# EAGLE design SolderStation_LCD_v1 (EAGLE 7.2.0)
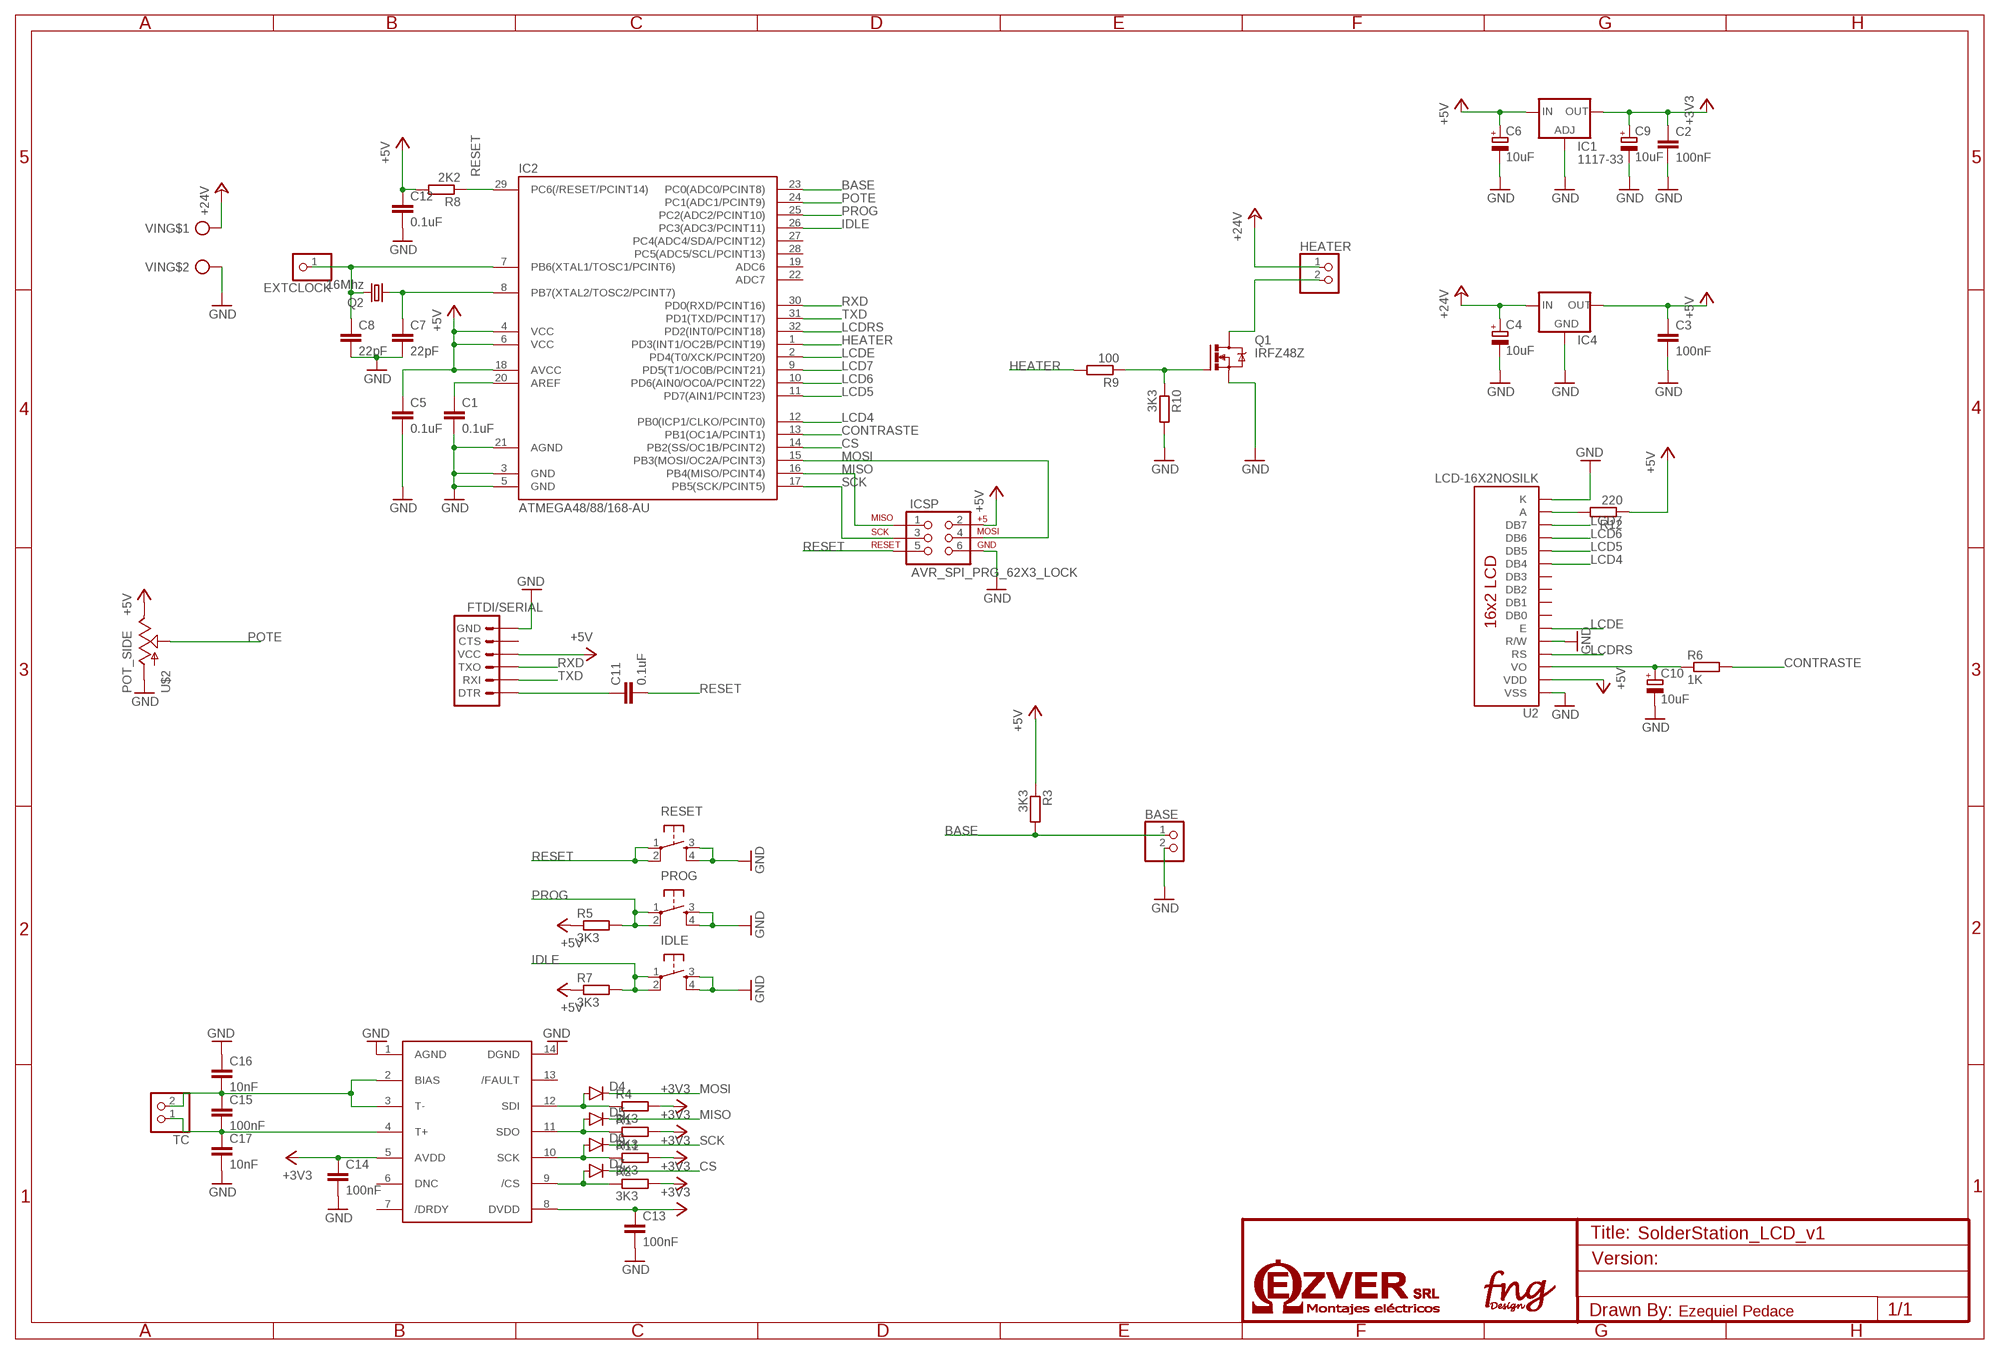
[diagram p0: schematic, sheet 1]

## Parts
BASE  PINHD-1X2  [1X02]
C1  0.1uF  C-EUC1206K  [C1206K]
C2  100nF  C-EUC1206K  [C1206K]
C3  100nF  C-EUC1206K  [C1206K]
C4  10uF  CPOL-EUCT3528  [CT3528]
C5  0.1uF  C-EUC1206K  [C1206K]
C6  10uF  CPOL-EUCT3528  [CT3528]
C7  22pF  C-EUC1206K  [C1206K]
C8  22pF  C-EUC1206K  [C1206K]
C9  10uF  CPOL-EUCT3528  [CT3528]
C10  10uF  CPOL-EUCT3528  [CT3528]
C11  0.1uF  C-EUC1206K  [C1206K]
C12  0.1uF  C-EUC1206K  [C1206K]
C13  100nF  C-EUC1206K  [C1206K]
C14  100nF  C-EUC1206K  [C1206K]
C15  100nF  C-EUC1206K  [C1206K]
C16  10nF  C-EUC1206K  [C1206K]
C17  10nF  C-EUC1206K  [C1206K]
D4  DIODESOD123  [SOD-123]
D5  DIODESOD123  [SOD-123]
D6  DIODESOD123  [SOD-123]
D7  DIODESOD123  [SOD-123]
EXTCLOCK  PINHD-1X1  [1X01]
FTDI/SERIAL  ARDUINO_SERIAL_PROGRAMLOCK  [1X06_LOCK]
HEATER  PINHD-1X2  [1X02]
IC1  1117-33  LD117ADT33TR  [DPACK]
IC2  ATMEGA48/88/168-AU  [TQFP32-08]
IC4  78XXL  [78XXL]
ICSP  AVR_SPI_PRG_62X3_LOCK  [2X3_LOCK]
IDLE  TAC_SWITCHPTH  [TACTILE-PTH]
PROG  TAC_SWITCHPTH  [TACTILE-PTH]
Q1  IRFZ48Z  [TO220BH]
Q2  16Mhz  CRYSTALHC49U70  [HC49U70]
R1  3K3  R-EU_M1206  [M1206]
R2  3K3  R-EU_M1206  [M1206]
R3  3K3  R-EU_M1206  [M1206]
R4  3K3  R-EU_M1206  [M1206]
R5  3K3  R-EU_M1206  [M1206]
R6  1K  R-EU_M1206  [M1206]
R7  3K3  R-EU_M1206  [M1206]
R8  2K2  R-EU_M1206  [M1206]
R9  100  R-EU_M1206  [M1206]
R10  3K3  R-EU_M1206  [M1206]
R11  3K3  R-EU_M1206  [M1206]
R12  220  R-EU_M1206  [M1206]
RESET  TAC_SWITCHPTH  [TACTILE-PTH]
TC  PINHD-1X2  [1X02]
TC1  MAX31856  [TSSOP-14]
U2  LCD-16X2NOSILK  [LCD-16X2_NOSILK]
U$2  POT_SIDE  [POT_ALPHA_SIDE]
VIN  CON2  [CON2]

## Nets
+3V3: C2.1 C9.+ C13.1 C14.1 IC1.4(OUT) R1.2 R2.2 R4.2 R11.2 TC1.5(AVDD) TC1.8(DVDD)
+5V: C3.1 C5.1 C6.+ C12.1 FTDI/SERIAL.4(VCC) IC1.3(IN) IC2.4(VCC) IC2.6(VCC) IC2.18(AVCC) IC4.OUT ICSP.2 R3.1 R5.1 R7.1 R8.2 R12.1 U2.2(VDD) U$2.3(E)
+24V: C4.+ HEATER.1 IC4.IN VIN.1
BASE: BASE.1 IC2.23(PC0(ADC0/PCINT8)) R3.2
CONTRASTE: IC2.13(PB1(OC1A/PCINT1)) R6.2
CS: D7.C IC2.14(PB2(SS/OC1B/PCINT2))
GND: BASE.2 C1.2 C2.2 C3.2 C4.- C5.2 C6.- C7.2 C8.2 C9.- C10.- C12.2 C13.2 C14.2 C16.1 C17.2 FTDI/SERIAL.6(GND) IC1.1(ADJ) IC2.3(GND) IC2.5(GND) IC2.21(AGND) IC4.GND ICSP.6 IDLE.3 IDLE.4 PROG.3 PROG.4 Q1.S R10.2 RESET.3 RESET.4 TC1.1(AGND) TC1.14(DGND) U2.1(VSS) U2.5(R/W) U2.16(K) U$2.1(A) VIN.2
HEATER: IC2.1(PD3(INT1/OC2B/PCINT19)) R9.2
IDLE: IC2.26(PC3(ADC3/PCINT11)) IDLE.1 IDLE.2 R7.2
LCD4: IC2.12(PB0(ICP1/CLKO/PCINT0)) U2.11(DB4)
LCD5: IC2.11(PD7(AIN1/PCINT23)) U2.12(DB5)
LCD6: IC2.10(PD6(AIN0/OC0A/PCINT22)) U2.13(DB6)
LCD7: IC2.9(PD5(T1/OC0B/PCINT21)) U2.14(DB7)
LCDE: IC2.2(PD4(T0/XCK/PCINT20)) U2.6(E)
LCDRS: IC2.32(PD2(INT0/PCINT18)) U2.4(RS)
MISO: D5.C IC2.16(PB4(MISO/PCINT4)) ICSP.1
MOSI: D4.C IC2.15(PB3(MOSI/OC2A/PCINT3)) ICSP.4
N$1: Q1.G R9.1 R10.1
N$2: D7.A R2.1 TC1.9(/CS)
N$3: D6.A R11.1 TC1.10(SCK)
N$4: D5.A R1.1 TC1.11(SDO)
N$5: HEATER.2 Q1.D
N$6: D4.A R4.1 TC1.12(SDI)
N$7: C7.1 IC2.8(PB7(XTAL2/TOSC2/PCINT7)) Q2.1
N$8: C10.+ R6.1 U2.3(VO)
N$9: C8.1 EXTCLOCK.1 IC2.7(PB6(XTAL1/TOSC1/PCINT6)) Q2.2
N$10: C1.1 IC2.20(AREF)
N$11: R12.2 U2.15(A)
N$14: C11.1 FTDI/SERIAL.1(DTR)
N$15: C15.2 C17.1 TC1.4(T+) TC.1
N$16: C15.1 C16.2 TC1.2(BIAS) TC1.3(T-) TC.2
POTE: IC2.24(PC1(ADC1/PCINT9)) U$2.2(S)
PROG: IC2.25(PC2(ADC2/PCINT10)) PROG.1 PROG.2 R5.2
RESET: C11.2 IC2.29(PC6(/RESET/PCINT14)) ICSP.5 R8.1 RESET.1 RESET.2
RXD: FTDI/SERIAL.3(TXO) IC2.30(PD0(RXD/PCINT16))
SCK: D6.C IC2.17(PB5(SCK/PCINT5)) ICSP.3
TXD: FTDI/SERIAL.2(RXI) IC2.31(PD1(TXD/PCINT17))
Unconnected: FTDI/SERIAL.5(CTS) IC2.19(ADC6) IC2.22(ADC7) IC2.27(PC4(ADC4/SDA/PCINT12)) IC2.28(PC5(ADC5/SCL/PCINT13)) TC1.6(DNC) TC1.7(/DRDY) TC1.13(/FAULT) U2.7(DB0) U2.8(DB1) U2.9(DB2) U2.10(DB3)

## Library data of the parts
BASE HEATER TC = pinhead:PINHD-1X2: PIN HEADER
C1-C3 C5 C7 C8 C11-C17 = rcl:C-EU: CAPACITOR, European symbol
C4 C6 C9 C10 = rcl:CPOL-EU: POLARIZED CAPACITOR, European symbol
D4-D7 = SparkFun-DiscreteSemi:DIODE: Diode These are standard reverse protection diodes and small signal diodes. SMA package can handle up to about 1A. SOD-323 can handle about 200mA. What the SOD-323 package when ordering, there are some mfgs out there that are 5-pin packages.
EXTCLOCK = pinhead:PINHD-1X1: PIN HEADER
FTDI/SERIAL = SparkFun-Connectors:ARDUINO_SERIAL_PROGRAM: FTDI connector footprints
IC1 = v-reg:LD117A?*: Low drop fixed and adjustable positive voltage regulators 1 A Source: http://www.st.com/stonline/products/literature/ds/7194/ld1117axx.pdf
IC2 = atmega8:ATMEGA48/88/168
IC4 = v-reg:78XXL: VOLTAGE REGULATOR
ICSP = SparkFun-Connectors:AVR_SPI_PRG_6: AVR ISP 6 Pin This is the reduced ISP connector for AVR programming. Common on Arduino. This footprint will take up less PCB space and can be used with a 10-pin to 6-pin adapter such as SKU: BOB-08508 **Special note about "TEST_POINT" package. The stop mask is on the top side, so if you want your programming test points to be on the bottom of your board, make sure to place this package on the bottom side of the board. This also ensure that the orientation to program from the bottom side will be correct.
IDLE PROG RESET = SparkFun-Electromechanical:TAC_SWITCH: Momentary Switch Button commonly used for reset or general input. Spark Fun Electronics SKU : COM-00097
Q1 = transistor-power:IRFZ48: N Channel HEXFET® Power MOSFET Logic Level Source: http://www.irf.com/product-info/datasheets/data/irfz48z.pdf
Q2 = crystal:CRYSTAL: CRYSTAL; OC_FARNELL: unknown; OC_NEWARK: unknown
R1-R12 = rcl:R-EU_: RESISTOR, European symbol
TC1 = SparkFun-AnalogIC:MAX31856
U2 = SparkFun-Displays:LCD-16X2: Standard text-only 16x2 parallel input LCD
U$2 = SparkFun-Electromechanical:POT_SIDE
VIN = con-phoenix-smkdsp:CON2

## Net classes
1 vcc: width 0.254 mm

## Board
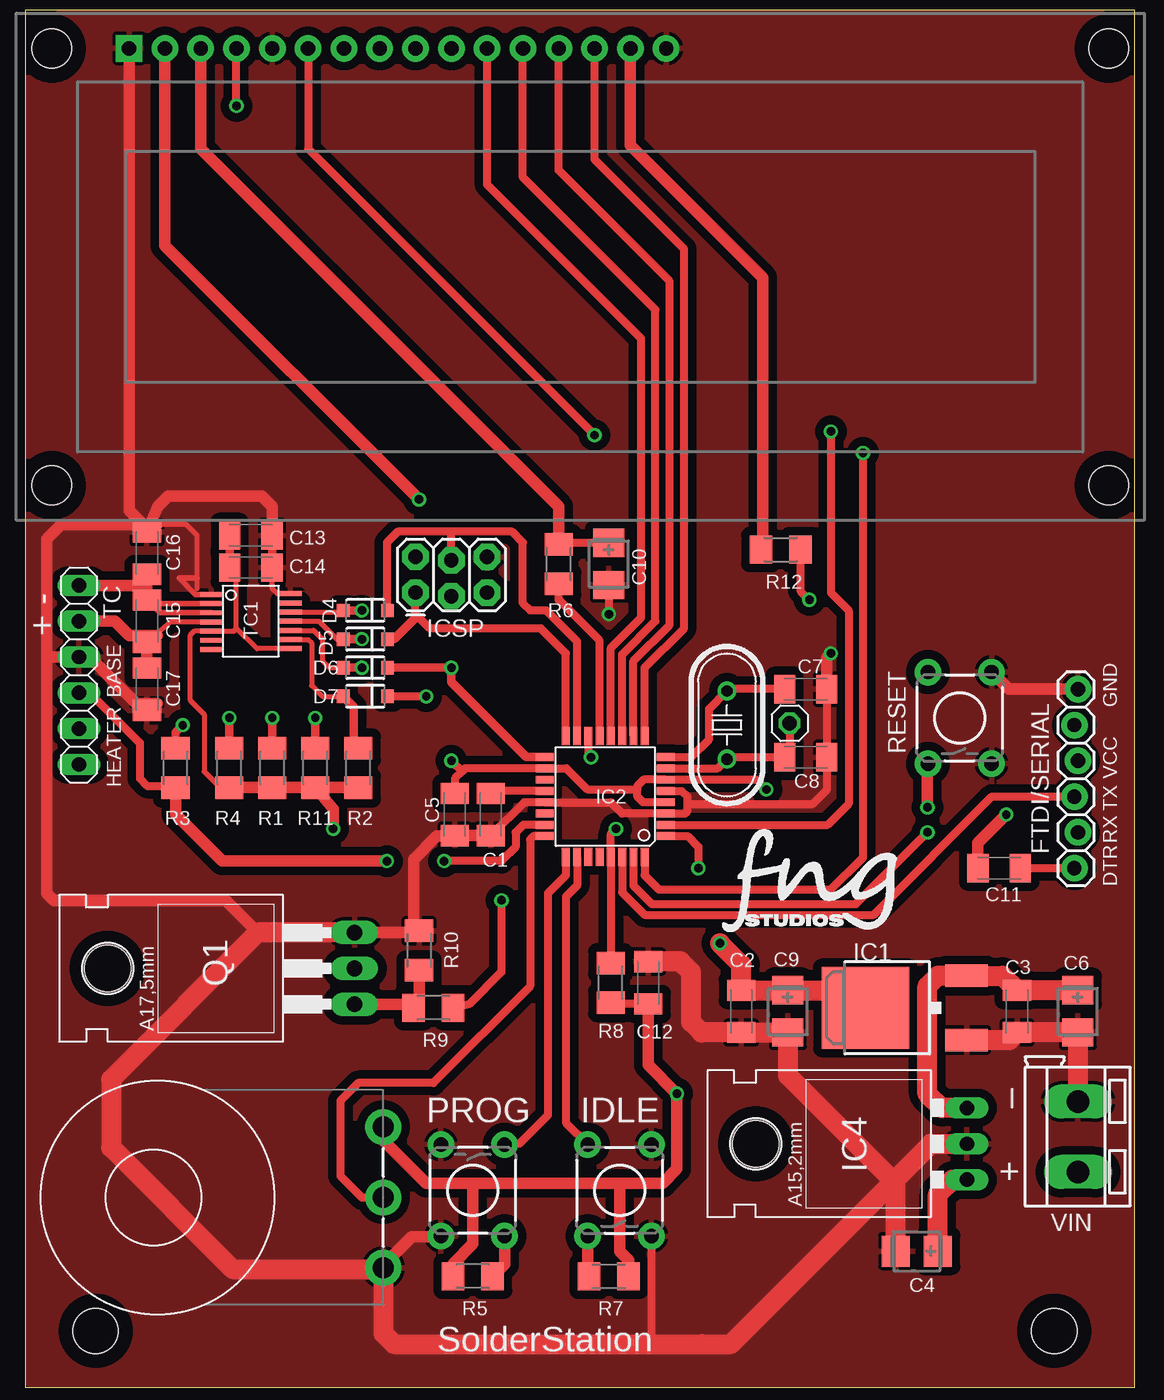
[diagram p1: board, top side]
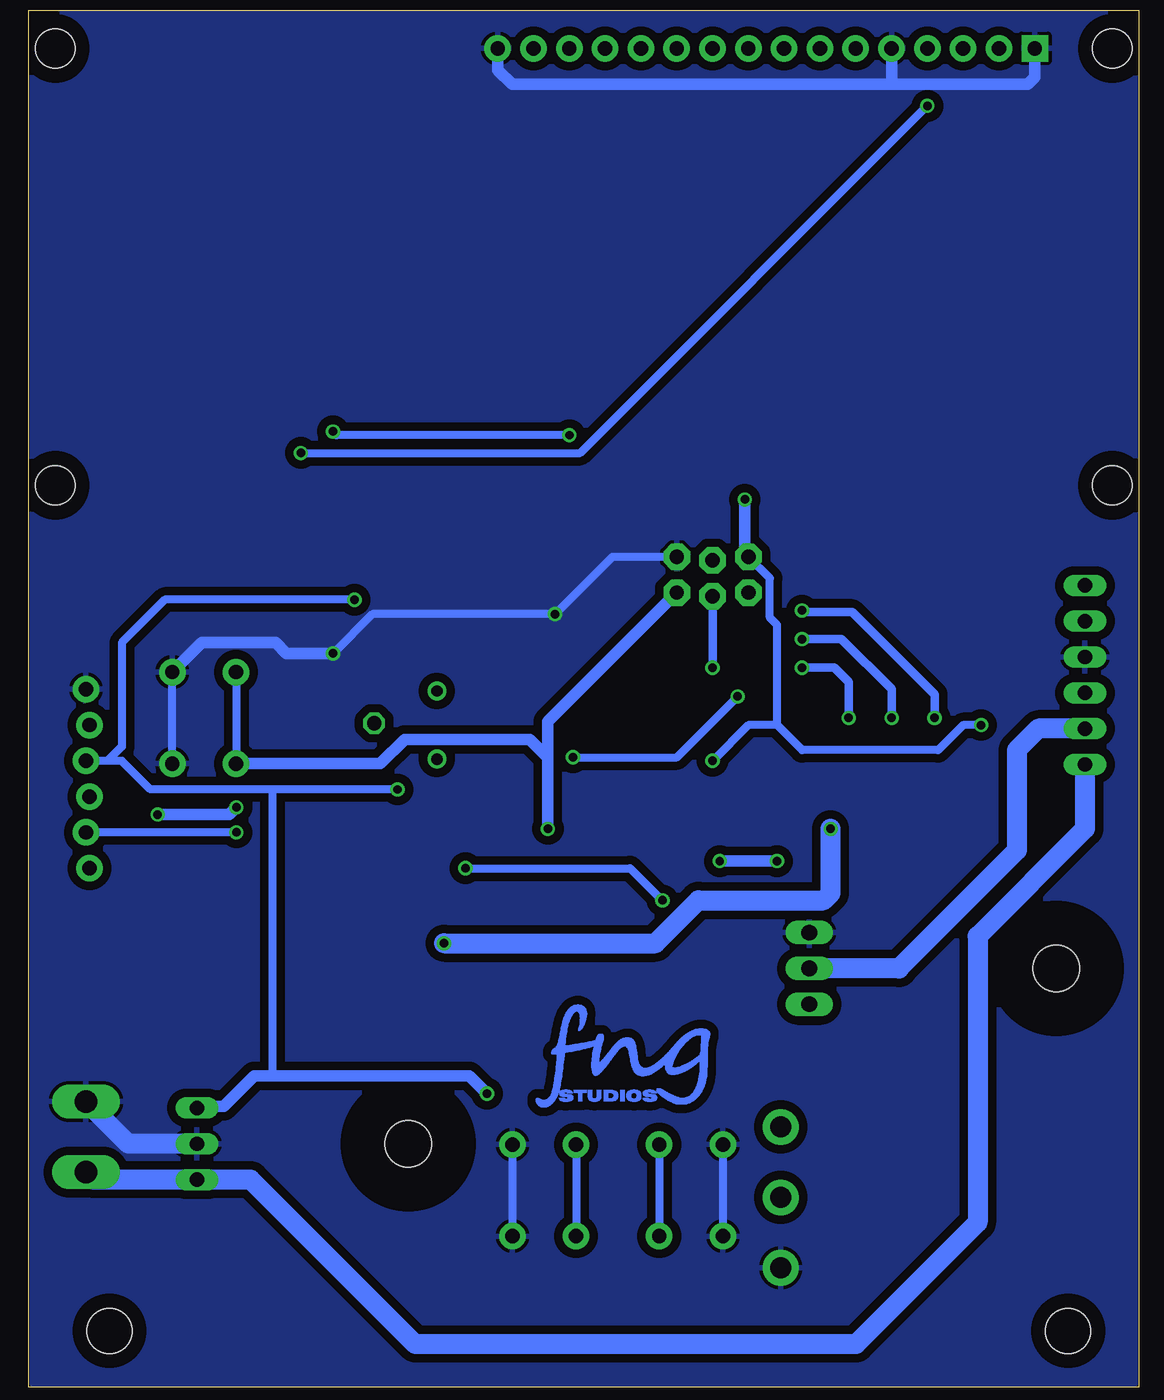
[diagram p2: board, bottom side, seen from below]

No outline drawn. Coordinates in mm, seen from the top.
Copper layers (1*16): Top 0.035mm / dielectric 1.5mm / Bottom 0.035mm
Design rules "default": minimum track width 10mil, minimum drill 0.6mm, track to track 8mil, track to pad 8mil, pad to pad 8mil, via to via 8mil, smd to smd 8mil, copper to edge 40mil, drill to drill 8mil, minimum pad ring 10mil, minimum via ring 8mil, stop-mask expansion 4mil, vias tented up to drill 0mil, thermal gap 10mil
Holes 3.2 mm at 5,4 73,4
Milling: 4 lines

### Footprints (pad centres in the part's own frame; a part is rotated, then mirrored left to right if it is on the bottom)
1X02 = drill 1.016 long: 1 -1.27,0; 2 1.27,0
C1206K = smd 1.5 x 2: 1 -1.5,0; 2 1.5,0
CT3528 = smd 2 x 2.2: + -1.5,0; - 1.5,0
SOD-123 = smd 0.9 x 0.95: A 1.575,0; C -1.575,0
1X01 = drill 1.016 octagon: 1 0,0
1X06_LOCK = drill 1.016 pad 1.88: 1 0,0; 2 2.54,-0.254; 3 5.08,0; 4 7.62,-0.254; 5 10.16,0; 6 12.7,-0.254
DPACK = smd 1.6 x 3: 1 -2.28,-4.8; 3 2.28,-4.8 | smd 5.8 x 6.2: 4 0,2.38
TQFP32-08 = smd 1.27 x 0.559: 1 -4.293,2.8; 2 -4.293,2; 3 -4.293,1.2; 4 -4.293,0.4; 5 -4.293,-0.4; 6 -4.293,-1.2; 7 -4.293,-2; 8 -4.293,-2.8; 17 4.293,-2.8; 18 4.293,-2; 19 4.293,-1.2; 20 4.293,-0.4; 21 4.293,0.4; 22 4.293,1.2; 23 4.293,2; 24 4.293,2.8 | smd 0.559 x 1.27: 9 -2.8,-4.293; 10 -2,-4.293; 11 -1.2,-4.293; 12 -0.4,-4.293; 13 0.4,-4.293; 14 1.2,-4.293; 15 2,-4.293; 16 2.8,-4.293; 25 2.8,4.293; 26 2,4.293; 27 1.2,4.293; 28 0.4,4.293; 29 -0.4,4.293; 30 -1.2,4.293; 31 -2,4.293; 32 -2.8,4.293
78XXL = drill 1.016 long: GND 0,-3.81; IN -2.54,-3.81; OUT 2.54,-3.81 | hole 3.302: 0,11.176
2X3_LOCK = drill 1.016 pad 1.88 octagon: 1 0,0; 2 0,2.54; 3 2.54,-0.254; 4 2.54,2.286; 5 5.08,0; 6 5.08,2.54
TACTILE-PTH = drill 1.016 pad 1.88: 1 -3.251,2.261; 2 3.251,2.261; 3 -3.251,-2.261; 4 3.251,-2.261
TO220BH = drill 1.118 long: D 0,-6.35; G -2.54,-6.35; S 2.54,-6.35 | hole 3.302: 0,11.176
HC49U70 = drill 0.813: 1 -2.413,0; 2 2.413,0
M1206 = smd 1.6 x 2: 1 -1.4,0; 2 1.4,0
TSSOP-14 = smd 1.6 x 0.35: 1 -2.8,1.9; 2 -2.8,1.25; 3 -2.8,0.6; 4 -2.8,-0.05; 5 -2.8,-0.7; 6 -2.8,-1.35; 7 -2.8,-2; 8 2.8,-1.95; 9 2.8,-1.3; 10 2.8,-0.65; 11 2.8,0; 12 2.8,0.65; 13 2.8,1.3; 14 2.8,1.95
LCD-16X2_NOSILK = drill 1.016 pad 1.88 square: 1 -32,15.5 | drill 1.016 pad 1.88: 2 -29.46,15.5; 3 -26.92,15.5; 4 -24.38,15.5; 5 -21.84,15.5; 6 -19.3,15.5; 7 -16.76,15.5; 8 -14.22,15.5; 9 -11.68,15.5; 10 -9.14,15.5; 11 -6.6,15.5; 12 -4.06,15.5; 13 -1.52,15.5; 14 1.02,15.5; 15 3.56,15.5; 16 6.1,15.5 | hole 2.8: -37.5,15.5; -37.5,-15.5; 37.5,15.5; 37.5,-15.5
POT_ALPHA_SIDE = drill 1.5 pad 2.54: 1 -5,-6.35; 2 0,-6.35; 3 5,-6.35
CON2 = drill 1.6 pad 1.8 long: 1 -2.5,0; 2 2.5,0

### Placement (x,y rotation side)
BASE  3.81,50.55 90 top
C1  33.02,40.64 270 top
C2  50.8,26.67 270 top
C3  70.36,26.67 270 top
C4  63.25,9.65 180 top
C5  30.48,40.64 270 top
C6  74.68,26.67 270 top
C7  55.37,49.53 0 top
C8  55.37,44.7 0 top
C9  54.1,26.67 270 top
C10  41.4,58.42 270 top
C11  69.09,36.83 180 top
C12  44.2,28.7 90 top
C13  16,60.45 0 top
C14  16,58.17 0 top
C15  8.64,54.36 270 top
C16  8.64,59.18 270 top
C17  8.64,49.53 270 top
D4  24.13,55.12 180 top
D5  24.13,53.09 180 top
D6  24.13,51.05 180 top
D7  24.13,49.02 180 top
EXTCLOCK  54.23,47.12 0 top
FTDI/SERIAL  74.42,36.83 90 top
HEATER  3.81,45.47 90 top
IC1  61.98,26.92 90 top
IC2  41.15,41.91 180 top
IC4  62.99,17.27 90 top
ICSP  27.69,56.39 0 top
IDLE  42.16,13.97 90 top
PROG  31.75,13.97 270 top
Q1  17.02,29.72 90 top
Q2  49.78,46.99 270 top
R1  17.53,43.94 270 top
R2  23.62,43.94 270 top
R3  10.67,43.94 270 top
R4  14.48,43.94 270 top
R5  31.75,7.87 0 top
R6  37.85,58.42 270 top
R7  41.4,7.87 180 top
R8  41.53,28.7 270 top
R9  28.96,26.92 0 top
R10  27.94,30.99 90 top
R11  20.57,43.94 270 top
R12  53.59,59.44 180 top
RESET  66.29,47.5 90 top
TC  3.81,55.63 90 top
TC1  16,54.36 0 top
U2  39.37,79.5 0 top
U$2  19.05,13.46 90 top
U$4  [LOGOFNG]  43.43,18.8 0 bottom
U$5  [LOGOFNGNAME1]  48.77,31.24 0 top
VIN  74.68,17.78 90 top

### Tracks (layer width: path | path; a pad name or v marks a point on that pad's centre or on a via)
+3V3  (via drill 0.6)
  Top 0.356: 14.99,53.85 14.79,53.66 TC1.5 12,53.66 11.68,53.34 11.68,48.77 12.7,47.75 12.7,43.69 13.85,42.54 | 14.99,53.85 14.99,57.94 C14.1 | TC1.8 16.43,52.41 14.99,53.85
  Top 0.61: R4.2 13.85,42.54 | C13.1 C14.1
  Top 0.813: v21.84,39.62 21.84,41.02 R11.2 | R4.2 R1.2 R11.2 | R11.2 R2.2
  Top 1.422: IC1.4 58.35,28.17 C9.+ C2.1 50.8,29.97 v49.28,31.5
  Bottom 1.422: v49.28,31.5 34.29,31.5 31.24,34.54 22.35,34.54 21.84,35.05 v21.84,39.62
+5V  (via drill 0.6)
  Top 0.559: IC2.4 43.83,41.51 43.43,41.91 43.43,42.42 | 43.43,42.42 43.43,42.67 43.87,43.11 IC2.6 51.89,43.11 v52.58,42.42 | 43.43,42.42 39.88,42.42 38.39,43.91 IC2.18 31.21,43.91 30.99,43.69 | 30.99,43.69 30.48,43.18 C5.1 | R3.1 10.67,46.48 v11.18,46.99 | v30.23,44.45 30.99,43.69 | C12.1 41.63,27.2 R8.2 | R12.1 54.99,56.51 v55.63,55.88
  Top 0.813: C12.1 44.2,22.86 v46.23,20.83 46.23,15.49 45.21,14.48 42.42,14.48 | U$2.3 25.4,17.53 28.45,14.48 32,14.48 | 32,14.48 42.42,14.48 | R5.1 30.35,8.76 31.75,10.16 31.75,14.22 32,14.48 | R7.1 42.8,9.01 42.16,9.65 42.16,14.22 42.42,14.48 | U2.2 9.91,81.02 v27.94,62.99
  Top 1.422: IC4.OUT 65.02,19.81 64.01,20.83 64.01,28.45 64.77,29.21 IC1.3 69.32,29.2 C3.1 C6.+
  Bottom 0.559: v52.58,42.42 61.47,42.42 | 61.47,42.42 70.1,42.42 72.14,44.45 73.15,44.45 | 73.15,44.45 FTDI/SERIAL.4 | v11.18,46.99 12.45,46.99 14.22,45.21 23.88,45.21 25.65,46.99 | 25.65,46.99 25.65,54.1 26.16,54.61 26.16,57.4 ICSP.2 | 25.65,46.99 27.69,46.99 v30.23,44.45 | v55.63,55.88 69.09,55.88 72.14,52.83 72.14,45.47 73.15,44.45 | 61.47,42.42 61.47,22.1
  Bottom 0.813: IC4.OUT 66.29,19.81 66.17,19.94 64.9,19.94 62.74,22.1 61.47,22.1 47.5,22.1 v46.23,20.83 | v27.94,62.99 27.94,59.18 ICSP.2
+24V
  Top 1.422: C4.+ 64.75,13.69 65.79,14.73 IC4.IN
  Bottom 1.422: 65.53,14.73 IC4.IN | IC4.IN 74.13,14.73 VIN.1 | IC4.IN 62.99,14.73 51.31,3.05 20.07,3.05 11.43,11.68 11.43,32 3.81,39.62 HEATER.1
BASE  (via drill 0.6)
  Top 0.559: IC2.23 35.34,39.91 34.8,39.37 34.8,38.35 33.78,37.34 v29.72,37.34 | BASE.1 4.57,49.28 8.13,45.72 8.13,43.18 8.64,42.67 10.54,42.67 R3.2
  Top 0.813: R3.2 10.67,40.64 13.97,37.34 v25.65,37.34
  Bottom 0.813: v25.65,37.34 v29.72,37.34
CONTRASTE
  Top 0.559: IC2.13 40.75,52.98 37.85,55.88 R6.2
CS  (via drill 0.6)
  Top 0.559: IC2.14 39.95,44.89 v40.13,44.7 | v28.45,49.02 D7.C
  Bottom 0.559: v40.13,44.7 32.77,44.7 v28.45,49.02
GND  (via drill 0.6)
  Top 0.356: TC1.14 17.86,56.31 17.53,56.64 17.53,58.4 C14.2 17.53,58.44 | TC1.1 12.58,56.26 | 12.19,56.64 12.19,57.4 12.19,60.45 11.43,61.21 9.42,61.21 C16.1 | 17.02,60.45 17.53,59.94
  Top 0.406: 12.58,56.26 12.07,56.26 10.92,57.4 12.19,57.4
  Top 0.559: C7.2 C8.2 56.9,44.68 56.9,42.42 55.88,41.4 46.99,41.4 | IC2.5 46.59,42.31 46.99,41.91 46.99,41.4 | 46.99,41.4 46.99,40.89 46.81,40.71 IC2.3 42.35,40.71 41.55,41.51 IC2.21 35.39,41.51 C1.2 | C10.- v41.4,54.86 | 7.37,61.22 7.37,61.21 | IDLE.3 44.42,3.28 44.2,3.05
  Top 0.61: 17.53,58.44 17.53,60.68 | 17.53,60.68 C13.2 | 17.53,60.68 17.25,60.68 17.02,60.45
  Top 0.813: C17.2 9.37,48.51 7.87,48.51 4.57,51.82 BASE.2 1.52,51.82 | C1.2 C5.2 30.46,39.12 29.21,39.12 27.56,37.46 27.56,32.38 27.43,32.26 | 47.75,3.3 48.01,3.05 | C7.2 56.87,51.79 v57.15,52.07 | 8.38,61.21 7.37,61.21 2.54,61.21 1.52,60.2 1.52,51.82 | 8.38,61.21 9.37,61.21 C16.1 9.4,62.48 10.16,63.25 16.76,63.25 17.53,62.48 17.53,60.73 C13.2 | 1.52,51.82 1.52,35.05 2.03,34.54 14.22,34.54 16.51,32.26 | FTDI/SERIAL.6 69.77,49.53 RESET.4 | Q1.S 27.43,32.26 | 27.43,32.26 27.81,32.26 R10.2 | U$2.1 25.4,8.64 27.43,10.67 29.44,10.67 PROG.4 | U2.1 7.37,62.23 8.38,61.21
  Top 1.422: Q1.S 16.51,32.26 6.1,21.84 6.1,17.02 14.73,8.38 25.32,8.38 U$2.1 25.4,3.81 26.16,3.05 44.2,3.05 48.01,3.05 50.04,3.05 61.75,14.76 | 61.75,14.76 64.26,17.27 IC4.GND | C4.- 61.75,14.48 | 61.75,14.48 61.75,14.76 | VIN.2 C6.- C3.2 69.83,24.64 IC1.1 | 61.75,14.48 54.1,22.12 C9.- C2.2 47.98,25.17 47.24,25.91 47.24,29.46 46.48,30.23 44.22,30.23 C12.2
  Bottom 0.559: RESET.3 68.56,50.01 68.92,50.38 RESET.4 | v57.15,52.07 54.36,54.86 v41.4,54.86 37.34,58.93 ICSP.6 | PROG.3 PROG.4 | IDLE.4 IDLE.3
  Bottom 0.813: v57.15,52.07 60.45,52.07 61.21,52.83 66.47,52.83 RESET.4 | U2.1 7.37,92.96 7.87,92.46 17.27,92.46 | 17.27,92.46 44.45,92.46 45.47,93.47 U2.16 | U2.5 17.53,92.71 17.27,92.46
  Bottom 1.422: IC4.GND 71.67,17.27 VIN.2
  pour Top (isolate 0.61): 0.25,97.54 78.49,97.54 78.49,0.25 0.25,0.25 0.25,2.54
  pour Bottom (isolate 0.61): 0.25,97.54 78.49,97.54 78.49,81.79 78.49,0.25 0.25,0.25 0.25,19.81
HEATER  (via drill 0.6)
  Top 0.559: IC2.1 47,39.11 47.75,38.35 v47.75,36.83 | v33.78,34.54 33.78,29.46 31.5,27.18 R9.2
  Bottom 0.559: v47.75,36.83 36.07,36.83 v33.78,34.54
IDLE
  Top 0.559: IC2.26 39.15,35.59 38.35,34.8 38.35,18.77 IDLE.2
  Top 0.813: IDLE.1 39.9,7.97 R7.2
  Bottom 0.559: IDLE.2 IDLE.1
LCD4
  Top 0.559: IC2.12 41.55,52.47 43.69,54.61 43.69,74.42 32.77,85.34 U2.11
LCD5
  Top 0.559: IC2.11 42.35,52 44.7,54.36 44.7,76.45 35.31,85.85 U2.12
LCD6
  Top 0.559: IC2.10 43.15,51.53 45.72,54.1 45.72,78.49 37.85,86.36 U2.13
LCD7
  Top 0.559: IC2.9 43.95,51.06 46.74,53.85 46.74,80.77 40.39,87.12 U2.14
LCDE  (via drill 0.6)
  Top 0.559: U2.6 20.07,87.88 v40.39,67.56 | v57.15,67.82 57.15,56.39 58.42,55.12 58.42,41.4 56.93,39.91 IC2.2
  Bottom 0.559: v40.39,67.56 56.9,67.56 v57.15,67.82
LCDRS  (via drill 0.6)
  Top 0.559: IC2.32 43.95,36.32 44.96,35.31 57.15,35.31 59.44,37.59 v59.44,66.29 | v14.99,90.93 U2.4
  Bottom 0.559: v59.44,66.29 39.62,66.29 v14.99,90.93
MISO
  Top 0.559: IC2.16 38.35,52.08 36.58,53.85 28.7,53.85 27.81,54.74 27.69,54.86 ICSP.1
  Top 0.61: D5.C 26.16,53.09 27.81,54.74
MOSI
  Top 0.559: IC2.15 39.15,52.93 36.96,55.12 35.81,55.12 35.31,55.63 35.31,59.94 34.54,60.71 30.23,60.71 | ICSP.4 30.23,60.71 | 30.23,60.71 26.42,60.71 25.65,59.94 25.65,55.17 D4.C
N$1
  Top 0.813: Q1.G 27.3,27.18 R9.1 27.94,27.31 R10.1
N$2
  Top 0.356: TC1.9 20.1,53.06 20.32,52.83 20.32,49.78 21.08,49.02 D7.A
  Top 0.61: R2.1 23.32,45.39 23.32,48.26 D7.A
N$3  (via drill 0.6)
  Top 0.356: TC1.10 20.46,53.71 21.08,53.09 21.08,51.56 21.59,51.05 D6.A
  Top 0.61: v20.57,47.5 R11.1 | D6.A v23.88,51.05
  Bottom 0.61: v23.88,51.05 21.59,51.05 20.57,50.04 v20.57,47.5
N$4  (via drill 0.6)
  Top 0.356: TC1.11 20.83,54.36 22.1,53.09 D5.A
  Top 0.61: R1.1 v17.53,47.5 | v23.88,53.09 D5.A
  Bottom 0.61: v17.53,47.5 17.53,49.53 21.08,53.09 v23.88,53.09
N$5
  Bottom 1.422: HEATER.2 7.11,46.74 8.64,45.21 8.64,38.1 17.02,29.72 Q1.D
N$6  (via drill 0.6)
  Top 0.356: TC1.12 22.44,55.01 D4.A
  Top 0.61: R4.1 v14.48,47.5 | v23.88,55.12 D4.A
  Bottom 0.61: v14.48,47.5 14.48,49.16 20.32,55.01 23.76,55.01 v23.88,55.12
N$7
  Top 0.559: IC2.8 47.25,44.71 48.51,45.97 48.51,48.13 Q2.1 49.91,49.53 C7.1
N$8
  Top 0.559: C10.+ 37.95,59.92 R6.1
  Top 0.813: U2.3 12.45,87.88 37.85,62.48 R6.1
N$9
  Top 0.559: IC2.7 49.12,43.91 Q2.2 49.91,44.7 C8.1 54.23,45.06 EXTCLOCK.1
N$10
  Top 0.559: IC2.20 33.19,42.31 C1.1
N$11
  Top 0.559: U2.15
  Top 0.813: U2.15 42.93,88.14 52.32,78.74 52.32,59.57 R12.2
N$14
  Top 0.559: FTDI/SERIAL.1 C11.1
N$15
  Top 0.356: TC1.4 10.34,54.31 C15.2
  Top 0.813: C17.1 C15.2 9.37,53.34 7.37,53.34 6.35,54.36 TC.1
N$16
  Top 0.356: 8.63,55.61 C15.1
  Top 0.406: TC1.2 8.89,55.61 C15.1 9.54,54.96 TC1.3
  Top 0.813: C16.2 C15.1 8.61,56.9 TC.2
POTE
  Top 0.559: IC2.24 36.06,39.11 35.81,38.86 35.81,28.45 28.96,21.59 23.62,21.59 22.35,20.32 22.35,14.99 23.88,13.46 U$2.2
PROG
  Top 0.559: IC2.25 38.35,36.32 37.08,35.05 37.08,19.3 35.05,17.27 34.06,17.27 PROG.1
  Top 0.813: PROG.2 34.01,8.73 R5.2
  Bottom 0.559: PROG.1 PROG.2
RESET  (via drill 0.6)
  Top 0.559: R8.1 41.55,30.12 IC2.29 41.55,39.26 v41.91,39.62
  Top 0.813: C11.2 67.59,38.63 v69.6,40.64 | v64.01,41.15 64.01,44.22 RESET.1
  Bottom 0.559: RESET.2 RESET.1
  Bottom 0.813: v69.6,40.64 64.52,40.64 v64.01,41.15 | RESET.1 53.8,44.25 52.07,45.97 43.18,45.97 41.91,44.7 | v41.91,39.62 41.91,44.7 | 41.91,44.7 41.91,47.24 ICSP.5
RXD
  Top 0.559: IC2.30 42.35,35.12 43.94,33.53 60.2,33.53 68.58,41.91 FTDI/SERIAL.3
SCK  (via drill 0.6)
  Top 0.61: IC2.17 35.55,44.71 30.23,50.04 v30.23,51.05 D6.C
  Bottom 0.61: v30.23,51.05 ICSP.3
TXD  (via drill 0.6)
  Top 0.559: IC2.31 43.15,35.59 44.45,34.29 58.93,34.29 v64.01,39.37
  Bottom 0.559: v64.01,39.37 FTDI/SERIAL.2

### Text on the board
tNames: + - | GND | VCC | TX | RX | DTR | _ | + | SolderStation